# EAGLE design SparkFun_Temperature_Sensor-STTS22H (EAGLE 9.6.2)
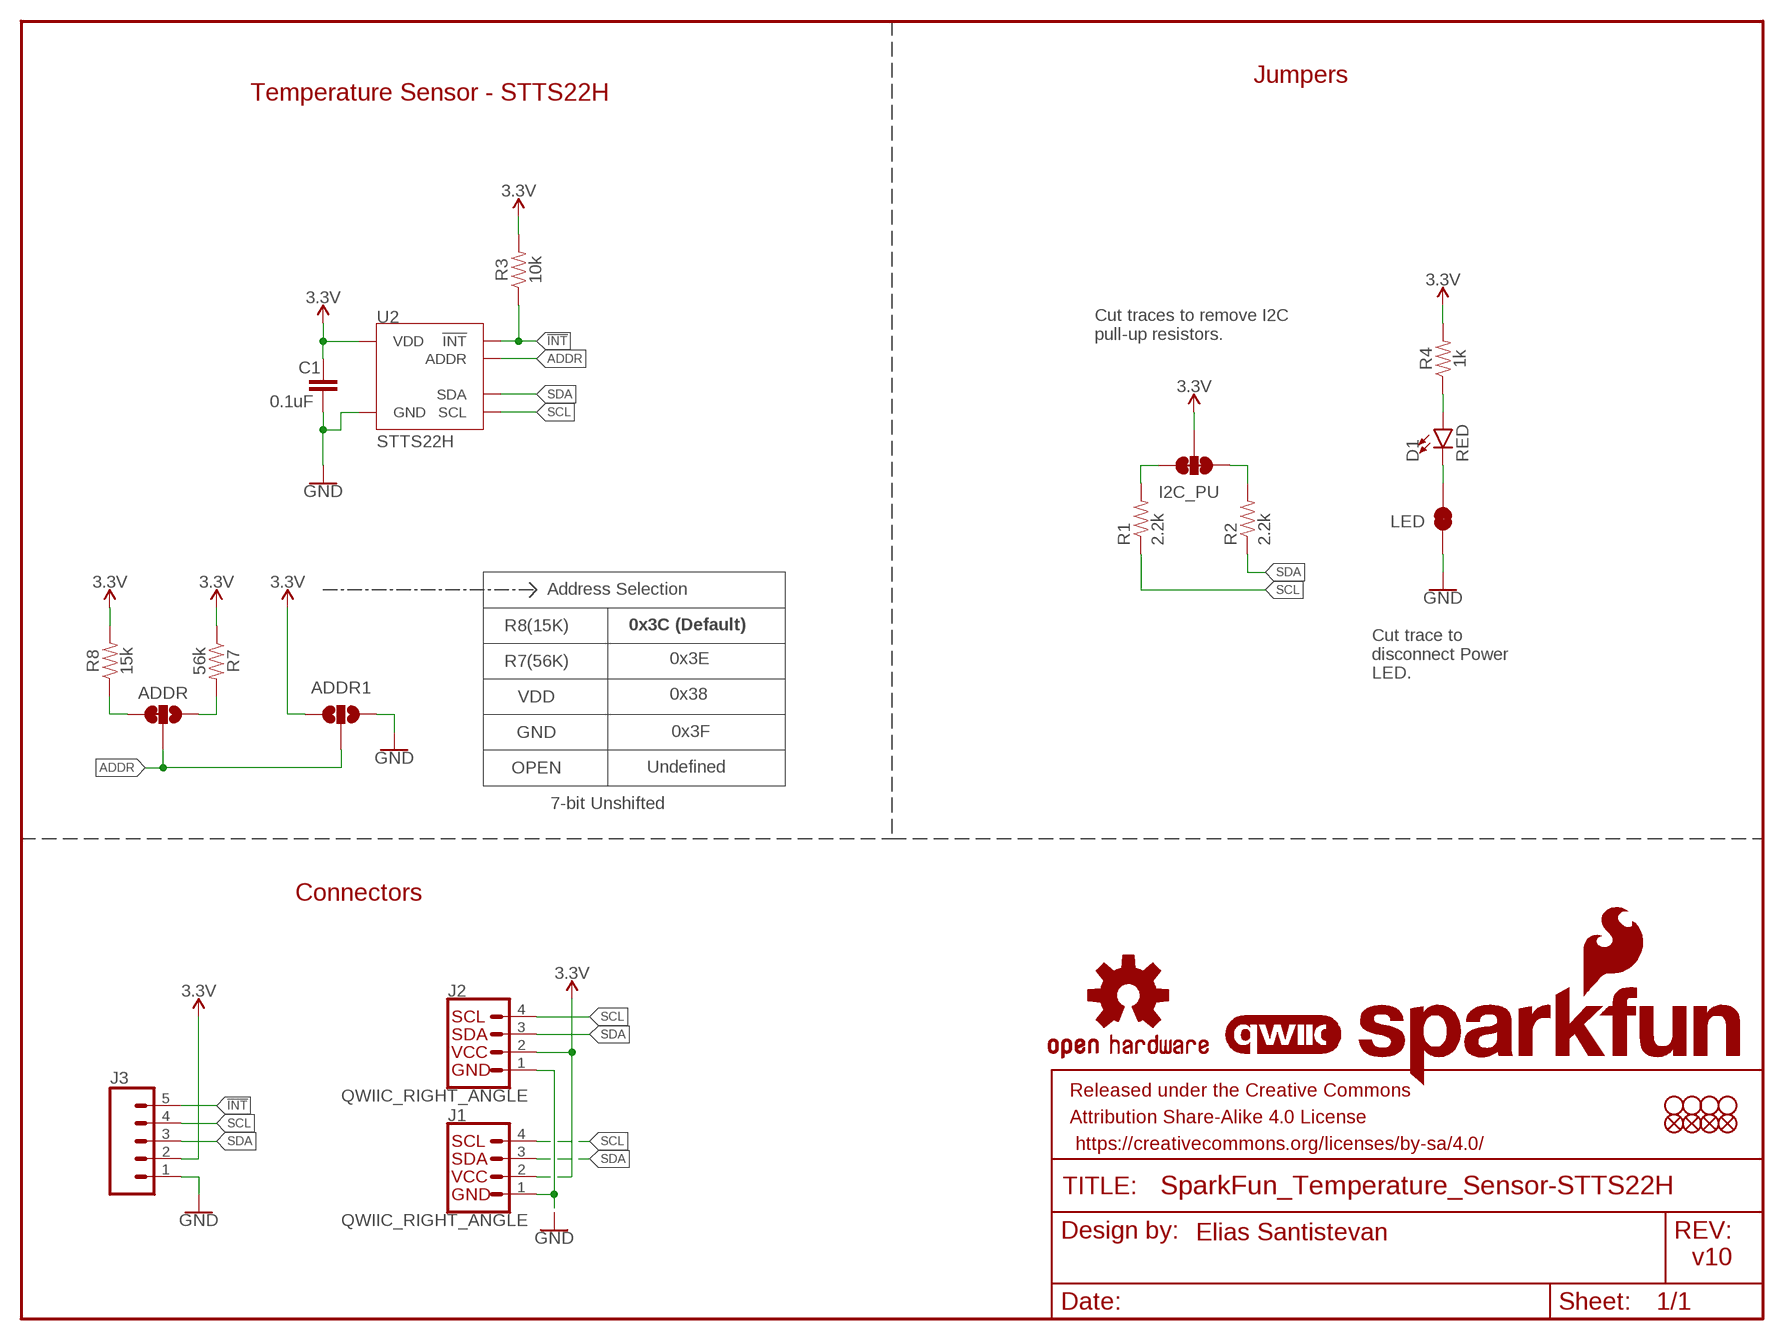
[diagram p0: schematic, sheet 1]

## Parts
ADDR  JUMPER-SMT_3_1-NC_TRACE_SILK  [SMT-JUMPER_3_1-NC_TRACE_SILK]
ADDR1  JUMPER-SMT_3_NO_SILK  [SMT-JUMPER_3_NO_SILK]
C1  0.1uF  0.1UF-0603-25V-(+80/-20%)  [0603]
D1  RED  LED-RED0603  [LED-0603]
FD1  FIDUCIAL1X2  [FIDUCIAL-1X2]
FD2  FIDUCIAL1X2  [FIDUCIAL-1X2]
FD3  FIDUCIAL1X2  [FIDUCIAL-1X2]
FD4  FIDUCIAL1X2  [FIDUCIAL-1X2]
FRAME1  FRAME-LETTER  [CREATIVE_COMMONS]
I2C_PU  S_MODE  JUMPER-SMT_3_2-NC_TRACE_SILK  [SMT-JUMPER_3_2-NC_TRACE_SILK]
J1  QWIIC_RIGHT_ANGLE  QWIIC_CONNECTORJS-1MM  [JST04_1MM_RA]
J2  QWIIC_RIGHT_ANGLE  QWIIC_CONNECTORJS-1MM  [JST04_1MM_RA]
J3  CONN_05NO_SILK  [1X05_NO_SILK]
LED  JUMPER-SMT_2_NC_TRACE_SILK  [SMT-JUMPER_2_NC_TRACE_SILK]
LOGO2  OSHW-LOGOMINI  [OSHW-LOGO-MINI]
LOGO3  SFE_LOGO_NAME_FLAME.1_INCH  [SFE_LOGO_NAME_FLAME_.1]
LOGO4  QWIIC_LOGO_4MM  [QWIIC_4MM]
R1  2.2k  2.2KOHM-0603-1/10W-1%  [0603]
R2  2.2k  2.2KOHM-0603-1/10W-1%  [0603]
R3  10k  10KOHM-0603-1/10W-1%  [0603]
R4  1k  1KOHM-0603-1/10W-1%  [0603]
R7  56k  56KOHM  [0603]
R8  15k  15KOHM-0603-1/10W-1%  [0603]
STANDOFF1  STAND-OFFTIGHT  [STAND-OFF-TIGHT]
STANDOFF2  STAND-OFFTIGHT  [STAND-OFF-TIGHT]
STANDOFF3  STAND-OFFTIGHT  [STAND-OFF-TIGHT]
STANDOFF5  STAND-OFFTIGHT  [STAND-OFF-TIGHT]
U2  STTS22H  [UDFN-6L]

## Nets
3.3V: ADDR1.3 C1.1 I2C_PU.2 J1.2 J2.2 J3.2 R3.2 R4.2 R7.1 R8.2 U2.P3(VDD)
!INT!: J3.5 R3.1 U2.P2(!INT!)
ADDR: ADDR1.2 ADDR.2 U2.P4(ADDR)
GND: ADDR1.1 C1.2 J1.1 J2.1 J3.1 LED.1 U2.P5(GND) U2.P7(GND)
N$2: D1.A R4.1
N$3: D1.C LED.2
N$4: ADDR.3 R8.1
N$5: I2C_PU.1 R1.2
N$6: I2C_PU.3 R2.2
N$7: ADDR.1 R7.2
SCL: J1.4 J2.4 J3.4 R1.1 U2.P1(SCL)
SDA: J1.3 J2.3 J3.3 R2.1 U2.P6(SDA)

## Notes on the sheet
- Jumpers
- Temperature Sensor - STTS22H
- Cut traces to remove I2C
  pull-up resistors.
- Address Selection
- R8(15K)
- 0x3C (Default)
- R7(56K) | 0x3E
- Cut trace to
  disconnect Power
  LED.
- VDD | 0x38
- GND
- 0x3F
- OPEN
- Undefined
- 7-bit Unshifted
- Connectors
- Elias Santistevan
- v10

## Library data of the parts
ADDR = SparkFun-Jumpers:JUMPER-SMT_3_1-NC_TRACE: Normally closed trace jumper (1 of 2 connections) This jumper has a trace between two pads so it's normally closed (NC). The other connection is normally open (NO). Use a razor knife to open the connection. For best results follow the IPC guidelines for cutting traces: Cutout at least 0.063 mm (0.005 in). Remove all loose material to clean up the cut area. Seal the cut with an approved epoxy. Reapply solder to reclose the connection, or to close the NO connection.
ADDR1 = SparkFun-Jumpers:JUMPER-SMT_3_NO: Normally open jumper This jumper has three pads in close proximity to each other. Apply solder to close the connection(s).
C1 = SparkFun-Capacitors:0.1UF: 0.1µF ceramic capacitors A capacitor is a passive two-terminal electrical component used to store electrical energy temporarily in an electric field.; PROD_ID: CAP-00810
D1 = SparkFun-LED:LED-RED: Red SMD LED Used in manufacturing of most products at SparkFun Packages: 0603 - SMD 0603 package [Product Link] <http://docs.avagotech.com/docs/AV02-0551EN> 0603 SMART - SMD 0603 SMART package ( more efficient and expensive)[Product Link] <http://www.osram-os.com/Graphics/XPic2/00077099_0.pdf> 1206 - SMD1206 package [Product Link] <https://www.sparkfun.com/datasheets/DevTools/LilyPad/Q150OVS4.pdff> SparkFun Products: Pro Mini 328 -5V <https://www.sparkfun.com/products/821> RedBoard <https://www.sparkfun.com/products/12757> IOIO-OTG <https://www.sparkfun.com/products/13613>; PROD_ID: DIO-00819
FD1-FD4 = SparkFun-Aesthetics:FIDUCIAL: Fiducial Alignment Points Point-of-reference for pick-and-place machines and other optical instruments.
FRAME1 = SparkFun-Aesthetics:FRAME-LETTER: Schematic Frame - Letter Standard 8.5x11 US Letter frame; DESIGNER: Elias Santistevan
I2C_PU = SparkFun-Jumpers:JUMPER-SMT_3_2-NC_TRACE: Normally closed trace jumper (2 of 2 connections) This jumper has a trace between all three pads so they are normally closed (NC). Use a razor knife to open the connection(s). For best results follow the IPC guidelines for cutting traces: Cutout at least 0.063 mm (0.005 in). Remove all loose material to clean up the cut area. Seal the cut with an approved epoxy. Reapply solder to reclose the connection(s).
J1 J2 = SparkFun-Connectors:QWIIC_CONNECTOR: SparkFun I2C Standard Qwiic Connector An SMD 1mm pitch JST connector makes it easy and quick (get it? Qwiic?) to connect I2C devices to each other. The Qwiic system <http://www.sparkfun.com/qwiic> enables fast and solderless connection between popular platforms and various sensors and actuators. We carry 200mm <https://www.sparkfun.com/products/14204>, 100mm <https://www.sparkfun.com/products/14205>, 50mm <https://www.sparkfun.com/products/14206>, and breadboard friendly <https://www.sparkfun.com/products/14207> Qwiic cables. We also offer 10 pcs strips <https://www.sparkfun.com/products/14323> the SMD connectors.; PROD_ID: CONN-13694
J3 = SparkFun-Connectors:CONN_05: Multi connection point. Often used as Generic Header-pin footprint for 0.1 inch spaced/style header connections On any of the 0.1 inch spaced packages, you can populate with these: Break Away Headers - Straight <https://www.sparkfun.com/products/116> (PRT-00116) Break Away Male Headers - Right Angle <https://www.sparkfun.com/products/553> (PRT-00553) Female Headers <https://www.sparkfun.com/products/115> (PRT-00115) Break Away Headers - Machine Pin <https://www.sparkfun.com/products/117> (PRT-00117) Break Away Female Headers - Swiss Machine Pin <https://www.sparkfun.com/products/743> (PRT-00743) For SCREWTERMINALS and SPRING TERMINALS visit here: Screw Terimnals on SparkFun.com <https://www.sparkfun.com/search/results?term=Screw+Terminals> (5mm/3.5mm/2.54mm spacing) This device is also useful as a general connection point to wire up your design to another part of your project. Our various solder wires solder well into these plated through hole pads. Hook-Up Wire - Assortment (Stranded, 22 AWG) <https://www.sparkfun.com/products/11375> (PRT-11375) Hook-Up Wire - Assortment (Solid Core, 22 AWG) <https://www.sparkfun.com/products/11367> (PRT-11367) View the entire wire category on our website here <https://www.sparkfun.com/categories/141> Special notes: Molex polarized connector foot print use with SKU : PRT-08231 with associated crimp pins and housings. 1MM SMD Version SKU: PRT-10208
LED = SparkFun-Jumpers:JUMPER-SMT_2_NC_TRACE: Normally closed trace jumper This jumper has a trace between two pads so it's normally closed (NC). Use a razor knife to open the connection. For best results follow the IPC guidelines for cutting traces: Cutout at least 0.063 mm (0.005 in). Remove all loose material to clean up the cut area. Seal the cut with an approved epoxy. Reapply solder to reclose the connection.
LOGO2 = SparkFun-Aesthetics:OSHW-LOGO: Open-Source Hardware (OSHW) Logo This logo indicates the piece of hardware it is found on incorporates a OSHW license and/or adheres to the definition of open source hardware found here: http://freedomdefined.org/OSHW
LOGO3 = SparkFun-Aesthetics:SFE_LOGO_NAME_FLAME: SparkFun Font Logo w/ Flame This is the SparkFun full logo. The logo on the schematic will always be the same size; the package variant is the height of the flame part of the logo. Default layer for the logo on the board is tSilk.
LOGO4 = SparkFun-Aesthetics:QWIIC_LOGO: Qwiic Logos for placement on schematic and PCB. The 5.5mm silk logo is best for placing next to Qwiic connector.
R1 R2 = SparkFun-Resistors:2.2KOHM: 2.2kΩ resistor A resistor is a passive two-terminal electrical component that implements electrical resistance as a circuit element. Resistors act to reduce current flow, and, at the same time, act to lower voltage levels within circuits. - Wikipedia; PROD_ID: RES-08272
R3 = SparkFun-Resistors:10KOHM: 10kΩ resistor A resistor is a passive two-terminal electrical component that implements electrical resistance as a circuit element. Resistors act to reduce current flow, and, at the same time, act to lower voltage levels within circuits. - Wikipedia; PROD_ID: RES-00824
R4 = SparkFun-Resistors:1KOHM: 1kΩ resistor A resistor is a passive two-terminal electrical component that implements electrical resistance as a circuit element. Resistors act to reduce current flow, and, at the same time, act to lower voltage levels within circuits. - Wikipedia; PROD_ID: RES-07856
R7 = SparkFun-Resistors:56KOHM; PROD_ID: RES-17211
R8 = SparkFun-Resistors:15KOHM: 15kΩ resistor A resistor is a passive two-terminal electrical component that implements electrical resistance as a circuit element. Resistors act to reduce current flow, and, at the same time, act to lower voltage levels within circuits. - Wikipedia; PROD_ID: RES-07854
STANDOFF1-STANDOFF3 STANDOFF5 = SparkFun-Hardware:STAND-OFF: Stand Off Drill holes for mechanically mounting via screws, standoffs, etc. Note: Use the keepout ring to avoid running the screw head into surrounding components. Variant Overviews STAND-OFF - Mechanical footprint for a #4 phillips button head screw. STAND-OFF-TIGHT - Mechanical footprint for a #4 phillips button head screw, Example SparkFun Products Screw - Phillips Head (1/4", 4-40, 10 pack) <https://www.sparkfun.com/products/10453> (PRT-10453) Screw - Phillips Head (1/2", 4-40, 10 pack) <https://www.sparkfun.com/products/10452> (PRT-10452) Screw - Phillips Head (3/4", 4-40, 10 pack) <https://www.sparkfun.com/products/10451> (PRT-10451) Screw - Phillips Head (1", 4-40, 10 pack) <https://www.sparkfun.com/products/10450> (PRT-10450)
U2 = STTS22H:STTS22H: STMicroelectronics STTS22H Temperature Sensor The STTS22H is a digital temperature sensor that communicates over a 2-wire I²C/SMBus 3.0 serial interface. Thanks to its factory calibration, the STTS22H offers high-end accuracy performance over the entire operating temperature range reaching as low as ±0.5 °C without requiring any further calibration at the application level. Datasheet <https://www.st.com/en/mems-and-sensors/stts22h.html#documentation>; PROD_ID: IC-17235

## Board
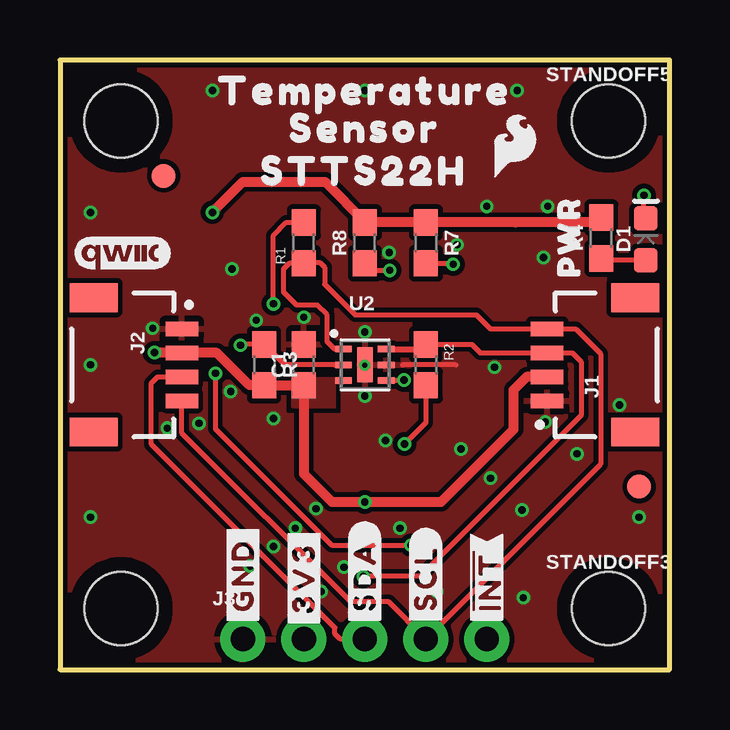
[diagram p1: board, top side]
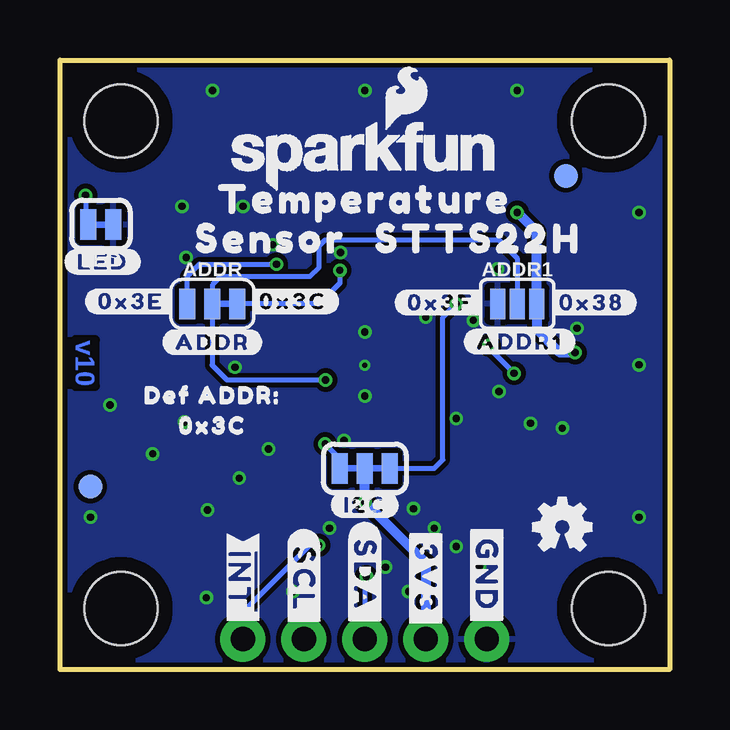
[diagram p2: board, bottom side, seen from below]

Size 25.4 x 25.4 mm. Coordinates in mm from the lower left corner, seen from the top.
Outline: 25.4,25.4 0,25.4 0,0 25.4,0 25.4,25.4
Copper layers (1*16): Top 0.035mm / dielectric 1.5mm / Bottom 0.035mm
Design rules "SparkFun-2-Layer-Minimum-JLCPCB": minimum track width 5mil, minimum drill 0.3mm, track to track 5mil, track to pad 5mil, pad to pad 5mil, via to via 5mil, smd to smd 5mil, copper to edge 7mil, drill to drill 7mil, minimum pad ring 5mil, minimum via ring 5mil, stop-mask expansion 2.5mil, vias tented up to drill 25mil, thermal gap 10mil

### Footprints (pad centres in the part's own frame; a part is rotated, then mirrored left to right if it is on the bottom)
SMT-JUMPER_3_1-NC_TRACE_SILK = smd 0.66 x 1.27: 1 -1.041,0; 2 0,0; 3 1.041,0
SMT-JUMPER_3_NO_SILK = smd 0.635 x 1.27: 1 -0.813,0; 2 0,0; 3 0.813,0
0603 = smd 1.1 x 1: 1 -0.85,0; 2 0.85,0
LED-0603 = smd 1 x 1: A -0.877,0; C 0.877,0
FIDUCIAL-1X2 = smd 1 x 1: 1 0,0
SMT-JUMPER_3_2-NC_TRACE_SILK = smd 0.66 x 1.27: 1 -1.041,0; 2 0,0; 3 1.041,0
JST04_1MM_RA = smd 0.6 x 1.35: 1 -1.5,0; 2 -0.5,0; 3 0.5,0; 4 1.5,0 | smd 1.2 x 2: NC1 2.8,-3.675; NC2 -2.8,-3.675
1X05_NO_SILK = drill 1.016 pad 1.88: 1 0,0; 2 2.54,0; 3 5.08,0; 4 7.62,0; 5 10.16,0
SMT-JUMPER_2_NC_TRACE_SILK = smd 0.66 x 1.27: 1 -0.521,0; 2 0.521,0
STAND-OFF-TIGHT = hole 3.048: 0,0
UDFN-6L = smd 0.7 x 0.27: P1 -0.89,0.65; P2 -0.89,0; P3 -0.89,-0.65; P4 0.89,-0.65; P5 0.89,0; P6 0.89,0.65 | smd 0.65 x 1.45: P7 0.01,0

### Placement (x,y rotation side)
ADDR  19.05,15.24 0 bottom
ADDR1  6.35,15.24 0 bottom
C1  10.16,12.7 90 top
D1  24.41,17.93 90 top
FD1  4.32,20.57 0 bottom
FD2  24.13,7.62 0 bottom
FD3  4.32,20.57 0 top
FD4  24.13,7.62 0 top
FRAME1  -19.05,-16.51 0 top  (outside the outline)
I2C_PU  12.7,8.38 180 bottom
J1  20.29,12.7 90 top
J2  5.08,12.7 270 top
J3  7.62,1.27 0 top
LED  23.7,18.54 180 bottom
LOGO2  4.47,5.95 0 bottom
LOGO3  12.7,21.41 0 bottom
LOGO4  2.62,17.35 0 top
R1  10.16,17.78 90 top
R2  15.24,12.7 270 top
R3  8.51,12.7 270 top
R4  22.56,17.98 90 top
R7  15.24,17.78 270 top
R8  12.7,17.78 90 top
STANDOFF1  2.54,22.86 0 top
STANDOFF2  2.54,2.54 0 top
STANDOFF3  22.86,2.54 0 top
STANDOFF5  22.86,22.86 0 top
U2  12.7,12.7 0 top
U$1  [#GND#3]  7.62,3.94 90 top
U$2  [#3V3#4]  10.16,3.81 90 top
U$3  [#SDA#5]  12.7,3.94 90 top
U$4  [#SCL#4]  15.24,3.81 90 top
U$5  [#SDA#7]  12.7,3.91 270 bottom
U$6  [#ADDR#6]  19.05,13.64 0 bottom
U$7  [#SCL#6]  15.24,3.76 270 bottom
U$8  [#ADDR1#9]  6.25,13.67 0 bottom
U$9  [#GND#3]  7.62,3.94 270 bottom
U$10  [#3V3#4]  10.16,3.81 270 bottom
U$11  [##INT##9]  17.78,3.68 270 bottom
U$12  [#0X3C#25]  15.7,15.34 0 bottom
U$13  [#0X3E#25]  22.45,15.34 0 bottom
U$14  [#0X3F#25]  9.55,15.29 0 bottom
U$15  [#0X38#25]  3.25,15.29 0 bottom
U$16  [#LED#11]  23.62,16.99 0 bottom
U$17  [TEMPERATURE23]  12.7,19.61 0 bottom
U$18  [##INT##6]  17.78,3.68 90 top
U$19  [SENSOR24]  16.61,17.96 0 bottom
U$20  [SFE_LOGO_FLAME_.1]  18.95,21.84 0 top
U$21  [PWR9]  21.21,18.03 90 top
U$22  [STTS22H21]  7.98,17.96 0 bottom
U$23  [TEMPERATURE23]  12.7,24.13 0 top
U$24  [SENSOR24]  12.7,22.56 0 top
U$25  [#I2C#11]  12.7,6.86 0 bottom
U$26  [STTS22H21]  12.65,20.78 0 top
U$27  [DEF_ADDR#29]  19.05,11.43 0 bottom
U$28  [0X3C30]  19.05,10.16 0 bottom

### Tracks (layer width: path | path; a pad name or v marks a point on that pad's centre or on a via)
3.3V  (via drill 0.3)
  Top 0.406: J1.2 19.44,12.2 18.9,11.66 18.9,10.01 15.88,6.99 v12.7,6.99 11.33,6.99 10.16,8.15 C1.1 R3.2 7.89,11.85 6.54,13.2 J2.2 v3.94,13.2 v3.94,13.21 | R4.2 22.37,18.64 19,18.64 18.99,18.63 R7.1 R8.2 12.7,18.67 11.05,20.32 7.62,20.32 v6.35,19.05
  Bottom 0.406: I2C_PU.2 v12.7,6.99 10.16,4.45 J3.2 | v3.94,13.21 4.57,13.21 5.54,14.17 ADDR1.3 5.54,18.24 v6.35,19.05
  pour Top (no thermals): 11.84,11.94 11.43,11.94 11.43,10.92 9.7,10.92 9.7,12.14 11.84,12.14
!INT!  (via drill 0.3)
  Top 0.203: v7.52,13.51 7.56,13.55 R3.1 9.36,12.7 11.43,12.7 U2.P2 | v6.48,12.35 6.48,10.03 11.33,5.18 v14.63,5.18
  Bottom 0.203: v7.52,13.51 7.52,13.39 v6.48,12.35 | J3.5 17.78,2.4 15.91,4.27 15.9,4.27 14.99,5.18 v14.63,5.18
ADDR  (via drill 0.3)
  Top 0.203: U2.P4 13.61,12.06 v14.33,12.06
  Bottom 0.203: ADDR1.2 6.35,17.14 7.11,17.91 14.35,17.91 14.61,17.65 14.61,16.76 14.99,16.38 18.69,16.38 19.05,16.03 ADDR.2 19.06,15.23 19.06,12.69 18.44,12.06 v14.33,12.06
GND  (via drill 0.2, 0.3)
  Top 0.203: 16.51,12.7 14.28,12.7
  other vias: 16.71,9.19 20.22,10.31 14.17,5.89 4.47,10.06 7.11,11.58 8.89,10.46 10.16,14.68 21.54,8.99 24.13,6.35 19.3,3 1.27,6.35 1.27,12.7 1.27,19.05 6.35,24.13 19.05,24.13 12.7,24.13 11.84,4.27 12.75,5.84 5.79,10.26 7.92,4.32 19.25,6.65 15.7,3.25 13.56,9.55 10.87,3.25 8.89,5.13 12.7,14.07 12.7,11.4 10.67,6.71 9.8,5.89 17.93,7.98 20.14,17.17 17.78,19.3 20.32,19.3 23.32,11.02 13.72,17.37 16.54,17.7 8.18,14.55 3.86,14.22 7.16,16.69 18.11,12.6 12.7,12.67
  pour Top (isolate 0.203, rank 2): 25.4,0 25.4,25.4 0,25.4 0,0
  pour Bottom (isolate 0.203, rank 2): 0,0 0,25.4 25.4,25.4 25.4,0
N$2
  Top 0.203: D1.A 22.63,17.05 R4.1
N$3  (via drill 0.3)
  Top 0.203: D1.C 24.33,18.89 v24.33,19.76
  Bottom 0.203: v24.33,19.76 24.33,18.66 LED.2
N$4  (via drill 0.3)
  Top 0.203: R8.1 12.99,16.64 v13.74,16.64
  Bottom 0.203: v13.74,16.64 13.74,16.1 14.61,15.24 ADDR.3
N$5  (via drill 0.3)
  Top 0.203: v8.89,15.24 8.89,18.09 9.44,18.63 R1.2
  Bottom 0.203: v8.89,15.24 9.45,14.68 9.45,8.74 9.8,8.38 I2C_PU.1
N$6  (via drill 0.3)
  Top 0.203: R2.2 15.24,10.29 v14.35,9.4
  Bottom 0.203: v14.35,9.4 13.74,8.79 I2C_PU.3
N$7  (via drill 0.3)
  Top 0.203: R7.2 16.34,16.93 v16.38,16.89
  Bottom 0.203: v16.38,16.89 19.59,16.89 20.09,16.39 ADDR.1
SCL
  Top 0.203: J2.4 5.08,9.86 12.12,2.82 13.69,2.82 J3.4 22.53,8.56 22.53,13.16 21.49,14.2 J1.4 17.93,14.2 17.35,14.78 12.29,14.78 11.02,16.05 11.02,16.76 10.82,16.97 10.2,16.97 R1.1 9.55,16.93 9.31,16.7 9.31,15.73 9.86,15.19 10.72,15.19 11.12,14.78 11.12,13.66 11.44,13.35 U2.P1
SDA  (via drill 0.3)
  Top 0.203: v12.64,3.87 12.65,3.89 15.01,3.89 21.72,10.59 21.72,12.83 21.34,13.2 J1.3 17.51,13.2 17.16,13.55 R2.1 15.46,13.55 15.24,13.33 | J2.3 4.07,12.2 3.81,11.94 3.81,9.4 11.46,1.75 11.46,1.5 11.68,1.27 J3.3
  Top 0.254: U2.P6 15.22,13.35 15.24,13.33
  Bottom 0.203: v12.64,3.87 12.7,3.81 J3.3

### Text on the board
Bottom: v10
Measures: Units in Inches